# Altium schematic sheet 3V3_to_100mV.SchDoc
size A0
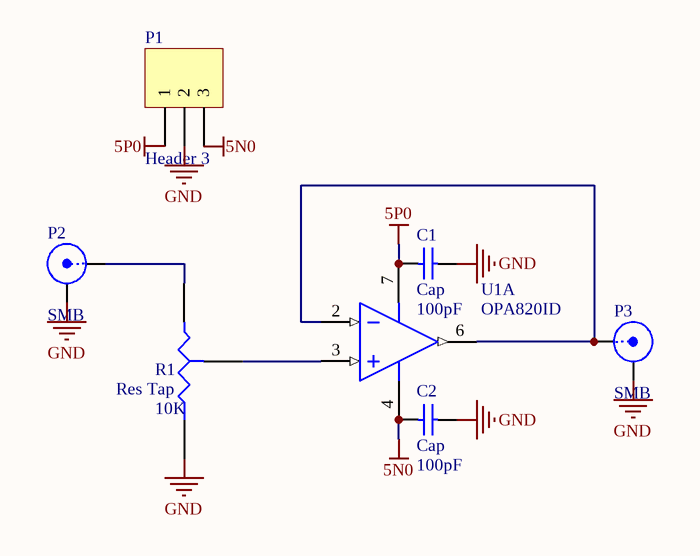
[diagram p0: 3V3_to_100mV.SchDoc]

## Parts
C1  Cap  value 100pF  [CAPC1608N]
C2  Cap  value 100pF  [CAPC1608N]
P1  Header 3  [HDR1X3]
P2  SMB  [SMB_V-RJ45]
P3  SMB  [SMB_V-RJ45]
R1  Res Tap  value 10K  [VR5]
U1  OPA820ID  [TI-D8_N]  (part A of 2)

## Nets
5N0: C2.1 P1.3 U1.4(VS-)
5P0: C1.1 P1.1 U1.7(VS+)
GND: C1.2 C2.2 P1.2 P2.2(Y) P3.2(Y) R1.2(B)
NetP2_1: P2.1(X) R1.1(A)
NetP3_1: P3.1(X) U1.2(IN-) U1.6(OUT)
NetR1_3: R1.3(TAP) U1.3(IN+)

## Library data of the parts
C1 C2 = Cap: Capacitor; Published: 8-Jun-2000; LatestRevisionDate: 17-Jul-2002; LatestRevisionNote: Re-released for DXP Platform.; PackageReference: RAD-0.3; Publisher: Altium Limited; PackageDescription: Radial Cap, Thru-Hole; 2 Leads; 0.3 in Pin Spacing
P1 = Header 3: Header, 3-Pin; LatestRevisionDate: 17-Jul-2002; LatestRevisionNote: Re-released for DXP Platform.; Publisher: Altium Limited
P2 P3 = SMB: SMB Straight Connector; LatestRevisionDate: 17-Jul-2002; LatestRevisionNote: Re-released for DXP Platform.; Publisher: Altium Limited
R1 = Res Tap: Tapped Resistor; pin to pad: 2>3 3>2; Sim Note: Enter the Resistance value and the set point into parameter fields.; Set Position: 0.5; Published: 24-Mar-1999; LatestRevisionDate: 17-Jul-2002; LatestRevisionNote: Re-released for DXP Platform.; PackageReference: VR3; Publisher: Altium Limited; PackageDescription: Variable Resistor, Thru-Hole; 3 Leads
U1 = OPA820ID: Unity Gain Stable, Low Noise, Voltage Feedback Operational Amplifier, 5 to 12 V, -40 to 85 degC, 8-pin SOIC (D8), Green (RoHS & no Sb/Br); Manufacturer: Texas Instruments; 2nd Harmonic(dBc): 90; 3rd Harmonic(dBc): 110; @ MHz: 1; BW @ Acl(MHz): 700; Diff Gain(%): 0.01; Diff Phase(deg): 0.03; Iib(Max)(nA): 2300; Iq per channel(Max)(mA): 6.4; Settling Time (0.1%)(Typ)(ns): 26; Slew Rate(Typ)(V/us): 240; Sub Family: High Output Current Amplifier (>=50mA), High Speed Amplifier (>=50MHz); THD (Fc is 1 MHz)(Typ)(dB): -85; Vn at Flatband(Typ)(nV/rtHz): 2.5; Vs(Max)(V): 12; Vs(Min)(V): 5; DatasheetVersion: SBOS303C; PackageVersion: 4040047-3/M, 06/2011; PackageReference: D8; PackageDescription: 8-Pin Plastic Small Outline, Body 4.9 x 3.9 mm, Pitch 1.27 mm; Supplier 1: Digi-Key; Supplier Part Number 1: 296-17130-5-ND; Supplier 2: Farnell; Supplier Part Number 2: 1560648; Supplier 3: Newark; Supplier Part Number 3: 21J8856; Supplier 4: Mouser; Supplier Part Number 4: 595-OPA820ID; Acl, min stable gain(V/V): 1; Eco-Plan: Green (RoHS & no Sb/Br); Io(Typ)(mA): 110; Number of Channels: 1; Vio(Max)(mV): 1; Mounting Technology: Surface Mount; Code_JEDEC: MS-012; PartNumber: OPA820ID; ComponentLink1Description: Manufacturer URL; ComponentLink1URL: http://www.ti.com/; ComponentLink2Description: Datasheet; ComponentLink2URL: http://www.ti.com/general/docs/lit/getliterature.tsp?genericPartNumber=OPA820&fileType=pdf; ComponentLink3Description: Package Specification; ComponentLink3URL: http://www.ti.com/litv/pdf/msoi002j